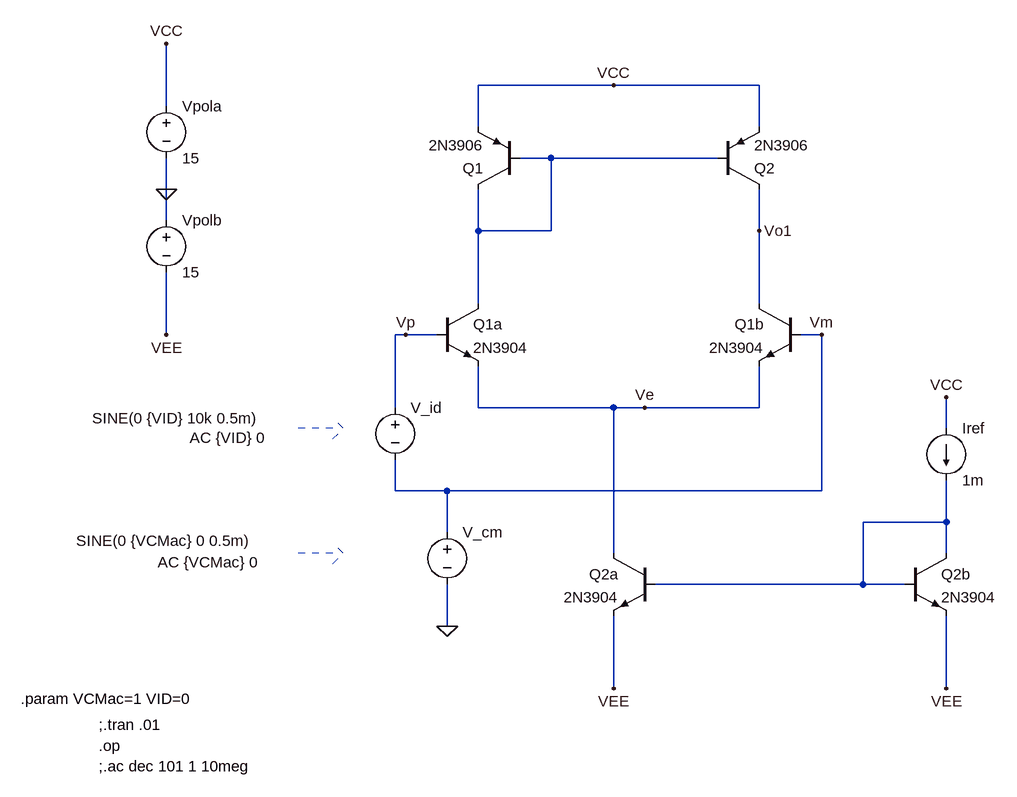
[diagram p0: schematic laboE1_2.asc]
laboE1_2.asc, the LTspice schematic file:
Version 4
SHEET 1 2404 1432
WIRE 288 -16 80 -16
WIRE 512 -16 288 -16
WIRE -400 16 -400 -80
WIRE 80 48 80 -16
WIRE 512 48 512 -16
WIRE 192 96 144 96
WIRE 448 96 192 96
WIRE -400 144 -400 96
WIRE -400 192 -400 144
WIRE 80 208 80 144
WIRE 192 208 192 96
WIRE 192 208 80 208
WIRE 512 208 512 144
WIRE 80 320 80 208
WIRE 512 320 512 208
WIRE -400 368 -400 272
WIRE -32 368 -48 368
WIRE 16 368 -32 368
WIRE 608 368 576 368
WIRE -48 480 -48 368
WIRE 80 480 80 416
WIRE 288 480 80 480
WIRE 336 480 288 480
WIRE 512 480 512 416
WIRE 512 480 336 480
WIRE 800 512 800 464
WIRE -48 608 -48 560
WIRE 32 608 -48 608
WIRE 608 608 608 368
WIRE 608 608 32 608
WIRE 800 656 800 592
WIRE 800 656 672 656
WIRE 32 672 32 608
WIRE 288 704 288 480
WIRE 800 704 800 656
WIRE 672 752 672 656
WIRE 672 752 352 752
WIRE 736 752 672 752
WIRE 32 816 32 752
WIRE 288 912 288 800
WIRE 800 912 800 800
FLAG 288 -16 VCC
FLAG -400 -80 VCC
FLAG -400 368 VEE
FLAG -400 144 0
FLAG 288 912 VEE
FLAG 512 208 Vo1
FLAG 800 464 VCC
FLAG 608 368 Vm
FLAG -32 368 Vp
FLAG 800 912 VEE
FLAG 32 816 0
FLAG 336 480 Ve
SYMBOL npn 16 320 R0
SYMATTR InstName Q1a
SYMATTR Value 2N3904
SYMBOL npn 576 320 M0
SYMATTR InstName Q1b
SYMATTR Value 2N3904
SYMBOL voltage -400 0 R0
WINDOW 123 0 0 Left 0
WINDOW 39 0 0 Left 0
SYMATTR InstName Vpola
SYMATTR Value 15
SYMBOL voltage -400 176 R0
WINDOW 123 0 0 Left 0
WINDOW 39 0 0 Left 0
SYMATTR InstName Vpolb
SYMATTR Value 15
SYMBOL npn 352 704 M0
SYMATTR InstName Q2a
SYMATTR Value 2N3904
SYMBOL npn 736 704 R0
SYMATTR InstName Q2b
SYMATTR Value 2N3904
SYMBOL voltage 32 656 R0
WINDOW 123 -445 62 Left 2
WINDOW 39 0 0 Left 0
WINDOW 3 -571 29 Left 2
SYMATTR Value2 AC {VCMac} 0
SYMATTR Value SINE(0 {VCMac} 0 0.5m)
SYMATTR InstName V_cm
SYMBOL current 800 512 R0
SYMATTR InstName Iref
SYMATTR Value 1m
SYMBOL voltage -48 464 R0
WINDOW 123 -316 62 Left 2
WINDOW 39 0 0 Left 0
WINDOW 3 -466 32 Left 2
SYMATTR Value2 AC {VID} 0
SYMATTR Value SINE(0 {VID} 10k 0.5m)
SYMATTR InstName V_id
SYMBOL pnp 144 144 R180
SYMATTR InstName Q1
SYMATTR Value 2N3906
SYMBOL pnp 448 144 M180
SYMATTR InstName Q2
SYMATTR Value 2N3906
TEXT -504 1000 Left 2 !.op
TEXT -504 1032 Left 2 !;.ac dec 101 1 10meg
TEXT -504 968 Left 2 !;.tran .01
TEXT -624 928 Left 2 !.param VCMac=1 VID=0
LINE Normal -144 512 -208 512 2
LINE Normal -144 704 -208 704 2
LINE Normal -144 704 -144 704 2
LINE Normal -128 704 -144 688 2
LINE Normal -144 720 -128 704 2
LINE Normal -128 512 -144 496 2
LINE Normal -144 528 -128 512 2

The netlist it stands for:
* laboE1_2.asc
Q1a N001 Vp Ve 0 2N3904
Q1b Vo1 Vm Ve 0 2N3904
Vpola VCC 0 15
Vpolb 0 VEE 15
Q2a Ve N002 VEE 0 2N3904
Q2b N002 N002 VEE 0 2N3904
V_cm Vm 0 SINE(0 {VCMac} 0 0.5m) AC {VCMac} 0
Iref VCC N002 1m
V_id Vp Vm SINE(0 {VID} 10k 0.5m) AC {VID} 0
Q1 N001 N001 VCC 0 2N3906
Q2 Vo1 N001 VCC 0 2N3906
.model NPN NPN
.model PNP PNP
.lib standard.bjt
.op
;.ac dec 101 1 10meg
;.tran .01
.param VCMac=1 VID=0
.backanno
.end